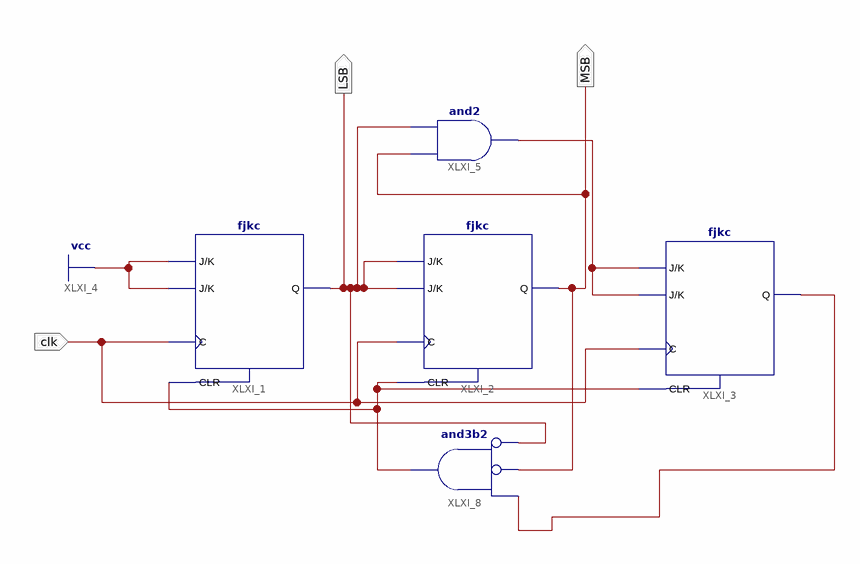
[diagram p0: schematic sheet 1]
// Xilinx ISE schematic mod4.sch (spartan6) as structural Verilog: 5 symbols, 3 ports
module mod4 (
  input  clk,
  output MSB,
  output LSB
);

  wire XLXN_6, XLXN_11, XLXN_16;

  fjkc XLXI_1 (.C(clk), .CLR(XLXN_11), .J(1'b1), .K(1'b1), .Q(LSB));
  fjkc XLXI_2 (.C(clk), .CLR(XLXN_11), .J(LSB), .K(LSB), .Q(MSB));
  fjkc XLXI_3 (.C(clk), .CLR(XLXN_11), .J(XLXN_6), .K(XLXN_6), .Q(XLXN_16));
  and XLXI_5 (XLXN_6, MSB, LSB);
  and XLXI_8 (XLXN_11, ~LSB, ~MSB, XLXN_16);  // and3b2
endmodule
